# Altium schematic sheet Vesta_wifi_power_3v3_1v8.SchDoc
size A4
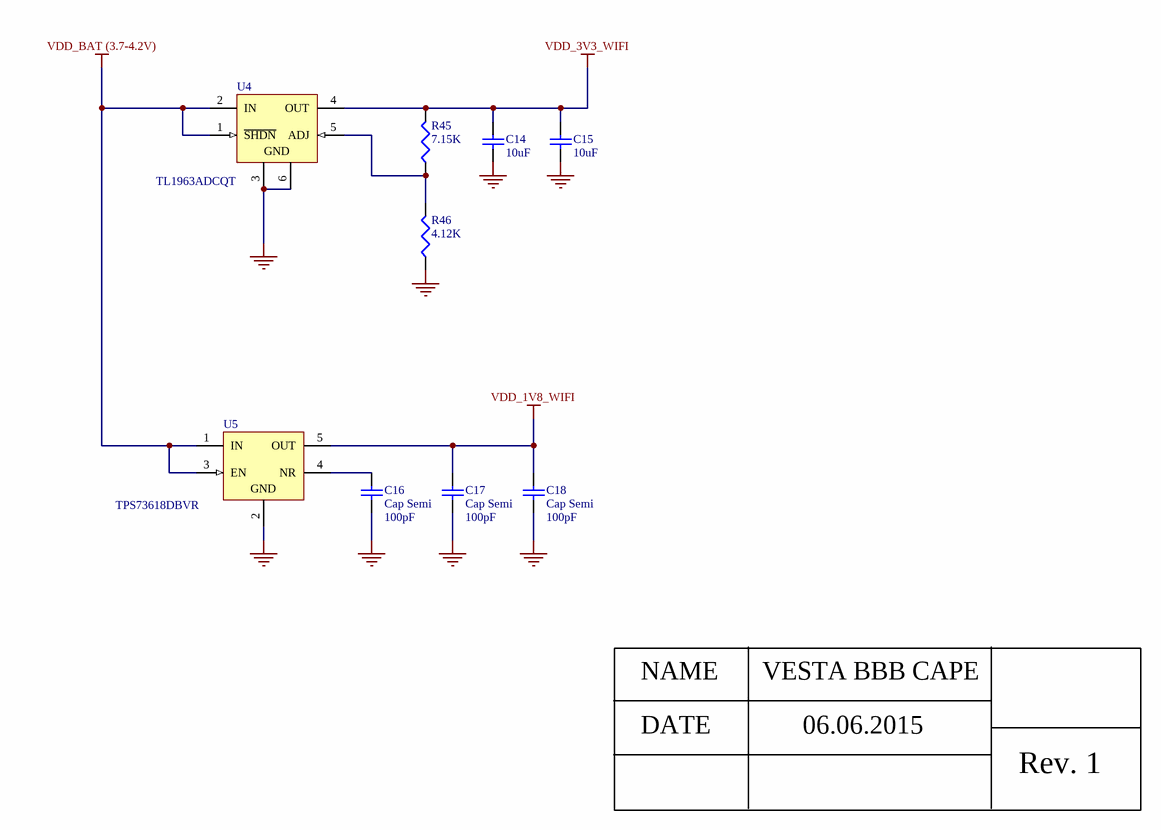
[diagram p0: Vesta_wifi_power_3v3_1v8.SchDoc]

## Parts
C14  10uF  [C1206]
C15  10uF  [C1206]
C16  Cap Semi  value 100pF  [C1206]
C17  Cap Semi  value 100pF  [C1206]
C18  Cap Semi  value 100pF  [C1206]
R45  7.15K  [J1-0603]
R46  4.12K  [J1-0603]
U4  TL1963ADCQT  [TI-DCQ6_M]
U5  TPS73618DBVR  [TI-DBV5_N]

## Nets
GND: C14.1 C15.1 C16.1 C17.1 C18.1 R46.1 U4.3(GND) U4.6(GND) U5.2(GND)
VDD_1V8_WIFI: C17.2 C18.2 U5.5(OUT)
VDD_3V3_WIFI: C14.2 C15.2 R45.2 U4.4(OUT)
VDD_BAT (3.7-4.2V): U4.1(~{SHDN}) U4.2(IN) U5.1(IN) U5.3(EN)
NetC16_2: C16.2 U5.4(NR)
NetR45_1: R45.1 R46.2 U4.5(ADJ)

## Notes on the sheet
- NAME
- VESTA BBB CAPE
- DATE
- 06.06.2015
- Rev. 1

## Library data of the parts
C14 C15 = Cap Semi: Capacitor (Semiconductor SIM Model); Value: 100pF; Published: 8-Jun-2000; LatestRevisionDate: 29-May-2009; LatestRevisionNote: IPC-7351 Footprint Added.; PackageReference: C1206; Publisher: Altium Limited; PackageDescription: Chip Capacitor
C16-C18 = Cap Semi: Capacitor (Semiconductor SIM Model); Published: 8-Jun-2000; LatestRevisionDate: 29-May-2009; LatestRevisionNote: IPC-7351 Footprint Added.; PackageReference: C1206; Publisher: Altium Limited; PackageDescription: Chip Capacitor
R45 = Res3: Resistor; Value: 7.15; Published: 8-Jun-2000; LatestRevisionDate: 29-May-2009; LatestRevisionNote: IPC-7351 Footprint Added.; PackageReference: J1-0603; Publisher: Altium Limited; PackageDescription: Chip Resistor
R46 = Res3: Resistor; Value: 1K; Published: 8-Jun-2000; LatestRevisionDate: 29-May-2009; LatestRevisionNote: IPC-7351 Footprint Added.; PackageReference: J1-0603; Publisher: Altium Limited; PackageDescription: Chip Resistor
U4 = CMP-0395-00365-1: Single Output Fast Transient Response LDO, 1.5 A, Adjustable 1.21 to 20 V Output, 2.1 to 20 V Input, 6-pin SOT-223 (DCQ), -40 to 125 degC, Green (RoHS & no Sb/Br); Manufacturer: Texas Instruments; Vin(Min)(V): 2.1; Iq(Typ)(mA): 1; Vdo(Typ)(mV): 340; Vout Adj(Max)(V): 20; Iout(Max)(A): 1.5; Vout Adj(Min)(V): 1.21; SubFamily: Single Channel LDO; PackageDescription: 6-Pin Plastic Small Outline, Body 3.5 x 6.5 mm, Pitch 1.27 mm; ComponentLink3URL: http://www.ti.com/litv/pdf/mpds098c; ComponentLink2Description: Datasheet; Eco-Plan: Green (RoHS & no Sb/Br); PackageReference: DCQ6; ComponentLink1URL: http://www.ti.com/; PartNumber: TL1963ADCQT; ComponentLink3Description: Package Specification; PackageVersion: 4202109/D; DatasheetVersion: SLVS719F; ComponentLink2URL: http://www.ti.com/general/docs/lit/getliterature.tsp?genericPartNumber=TL1963A&fileType=pdf; ComponentLink1Description: Manufacturer URL; Mounting Technology: Surface Mount; Vin(Max)(V): 20
U5 = CMP-0395-00289-1: Single Output Low Noise LDO, 400 mA, Fixed 1.8 V Output, 1.7 to 5.5 V Input, with Reverse Current Protection, 5-pin SOT-23 (DBV), -40 to 85 degC, Green (RoHS & no Sb/Br); Manufacturer: Texas Instruments; Fixed Output Options(V): 1.8; Vin(Min)(V): 1.7; Accuracy(%): 1; Vin(Max)(V): 5.5; Rating: Catalog; Iq(Typ)(mA): 0.3; Iout(Max)(A): 0.4; Vdo(Typ)(mV): 75; SubFamily: Single Channel LDO; PackageVersion: 4073253-4/K; ComponentLink4Description: URL Link1; ComponentLink2URL: http://www.ti.com/general/docs/lit/getliterature.tsp?genericPartNumber=TPS73618&fileType=pdf; ComponentLink2Description: Datasheet; Vout Adj(Min)(V): 1.8; ComponentLink3URL: http://www.ti.com/litv/pdf/mpds018i; ComponentLink1URL: http://www.ti.com/; Code_JEDEC: MO-178; Vout Adj(Max)(V): 1.8; ComponentLink3Description: Package Specification; DatasheetVersion: SBVS038T; PartNumber: TPS73618DBVR; PackageReference: DBV5; Eco-Plan: Green (RoHS & no Sb/Br); Mounting Technology: Surface Mount; PackageDescription: 5-Pin Plastic Small Outline, Body 1.60 Ã— 2.90 mm, Pitch 0.95 mm; ComponentLink4URL: Samples URL:http://www.ti.com/product/tps73618#samples; ComponentLink1Description: Manufacturer URL